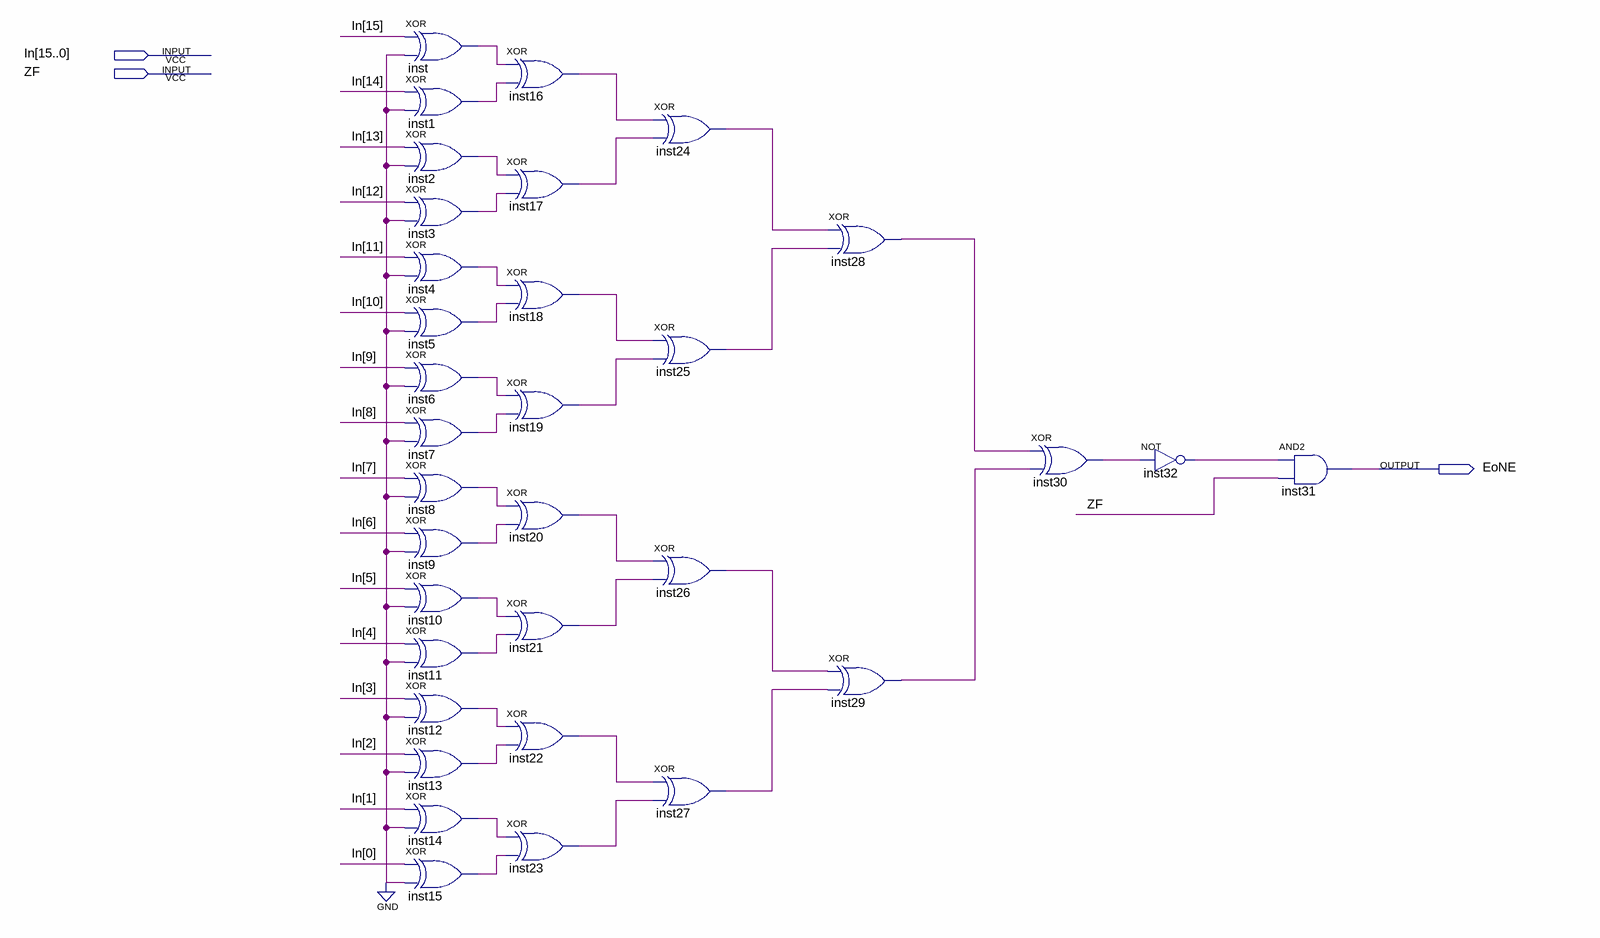
[diagram p0: schematic sheet]
// Quartus schematic Equal_Check.bdf as structural Verilog: 33 symbols, 3 pins
module Equal_Check (
  input  [15:0] In,
  input  ZF,
  output EoNE
);

  wire inst1_out, inst2_out, inst3_out, inst4_out, inst5_out, inst6_out, inst7_out, inst8_out, inst9_out,
       inst10_out, inst11_out, inst12_out, inst13_out, inst14_out, inst15_out, inst16_out, inst17_out,
       inst18_out, inst19_out, inst20_out, inst21_out, inst22_out, inst23_out, inst24_out, inst25_out,
       inst26_out, inst27_out, inst28_out, inst29_out, inst30_out, inst32_out, inst_out;

  xor inst (inst_out, In[15], 1'b0);
  xor inst1 (inst1_out, In[14], 1'b0);
  xor inst2 (inst2_out, In[13], 1'b0);
  xor inst3 (inst3_out, In[12], 1'b0);
  xor inst4 (inst4_out, In[11], 1'b0);
  xor inst5 (inst5_out, In[10], 1'b0);
  xor inst6 (inst6_out, In[9], 1'b0);
  xor inst7 (inst7_out, In[8], 1'b0);
  xor inst8 (inst8_out, In[7], 1'b0);
  xor inst9 (inst9_out, In[6], 1'b0);
  xor inst10 (inst10_out, In[5], 1'b0);
  xor inst11 (inst11_out, In[4], 1'b0);
  xor inst12 (inst12_out, In[3], 1'b0);
  xor inst13 (inst13_out, In[2], 1'b0);
  xor inst14 (inst14_out, In[1], 1'b0);
  xor inst15 (inst15_out, In[0], 1'b0);
  xor inst16 (inst16_out, inst_out, inst1_out);
  xor inst17 (inst17_out, inst2_out, inst3_out);
  xor inst18 (inst18_out, inst4_out, inst5_out);
  xor inst19 (inst19_out, inst6_out, inst7_out);
  xor inst20 (inst20_out, inst8_out, inst9_out);
  xor inst21 (inst21_out, inst10_out, inst11_out);
  xor inst22 (inst22_out, inst12_out, inst13_out);
  xor inst23 (inst23_out, inst14_out, inst15_out);
  xor inst24 (inst24_out, inst16_out, inst17_out);
  xor inst25 (inst25_out, inst18_out, inst19_out);
  xor inst26 (inst26_out, inst20_out, inst21_out);
  xor inst27 (inst27_out, inst22_out, inst23_out);
  xor inst28 (inst28_out, inst24_out, inst25_out);
  xor inst29 (inst29_out, inst26_out, inst27_out);
  xor inst30 (inst30_out, inst28_out, inst29_out);
  not inst32 (inst32_out, inst30_out);
  and inst31 (EoNE, inst32_out, ZF);
endmodule
